# Altium project Driver.PrjPcb
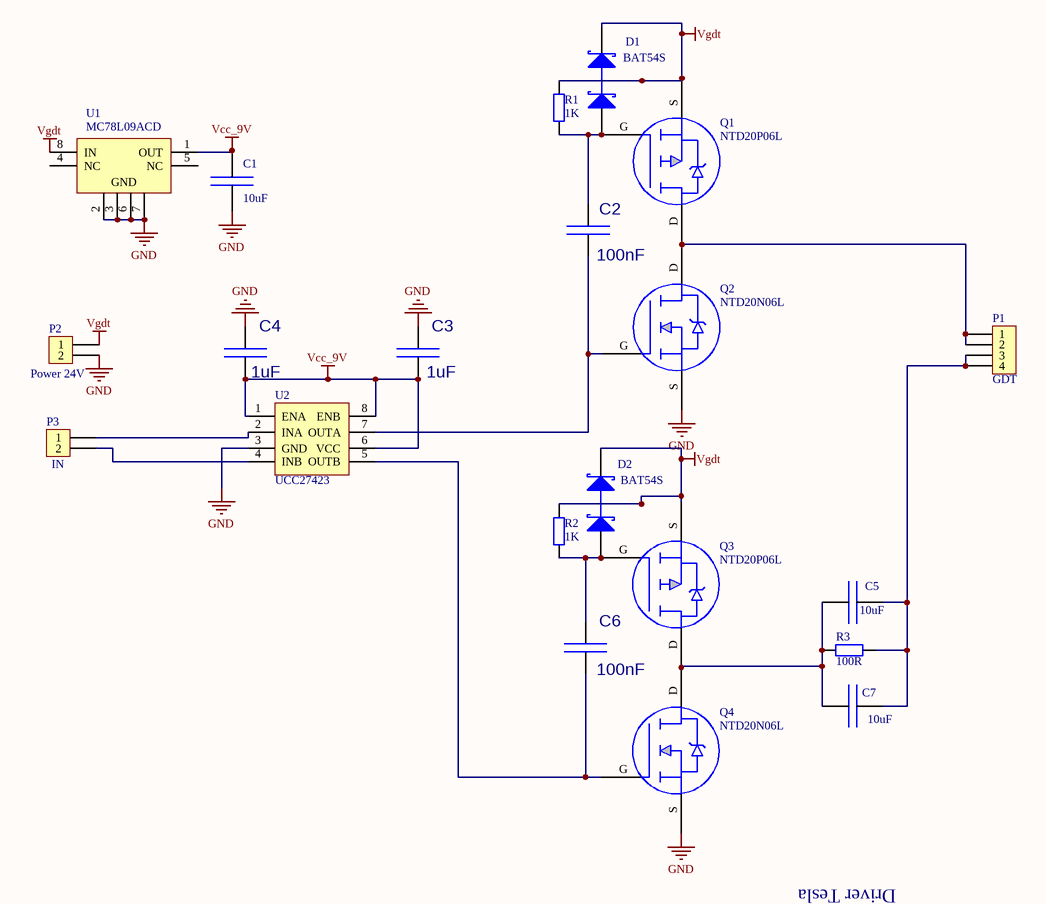
[diagram p0: Driver.SchDoc]
1 sheet, 21 parts. Net scope: global (net labels, ports and power ports of the same name join across sheets).
Board file: Driver.PcbDoc

## Sheet Driver.SchDoc
size A4

### Parts
C1  SMD_1206  [SMD-1206]  (value not drawn)
C2  value 100nF  [C0805]  (hidden comment: KONDENS_SMD)
C3  value 1uF  [C0805]  (hidden comment: KONDENS_SMD)
C4  value 1uF  [C0805]  (hidden comment: KONDENS_SMD)
C5  SMD_1206  [SMD-1206]  (value not drawn)
C6  value 100nF  [C0805]  (hidden comment: KONDENS_SMD)
C7  SMD_1206  [SMD-1206]  (value not drawn)
D1  BAT54S  [SOT23_N]
D2  BAT54S  [SOT23_N]
P1  WF-04MR  [WF-04MR]  (value not drawn)
P2  WF-02MR  [WF-02MR]  (value not drawn)
P3  WF-02MR  [WF-02MR]  (value not drawn)
Q1  NTD20P06L  [DPAK]
Q2  NTD20N06L  [DPAK]
Q3  NTD20P06L  [DPAK]
Q4  NTD20N06L  [DPAK]
R1  value 1K  [C0805]  (hidden comment: RES)
R2  value 1K  [C0805]  (hidden comment: RES)
R3  1206  [SMD-1206]  (value not drawn)
U1  MC78L09ACD  [751-05_N]
U2  UCC27423  [PDIP]

### Nets
GND: C1.2 C3.1(A) C4.1(A) P2.2 Q2.S(Source) Q4.S(Source) U1.2(GND) U1.3(GND) U1.6(GND) U1.7(GND) U2.3(GND)
Vcc_9V: C1.1 C3.2(B) C4.2(B) U1.1(OUT) U2.1(ENA) U2.6(VCC) U2.8(ENB)
Vgdt: D1.2(K) D1.3(C) D2.2(K) D2.3(C) P2.1 Q1.S(Source) Q3.S(Source) R1.2 R2.2 U1.8(IN)
NetC2_1: C2.1(A) D1.1(A) Q1.G(Gate) R1.1
NetC2_2: C2.2(B) Q2.G(Gate) U2.7(OUTA)
NetC5_1: C5.1 C7.1 Q3.D(Drain) Q4.D(Drain) R3.2
NetC5_2: C5.2 C7.2 P1.3 P1.4 R3.1
NetC6_1: C6.1(A) D2.1(A) Q3.G(Gate) R2.1
NetC6_2: C6.2(B) Q4.G(Gate) U2.5(OUTB)
NetP1_1: P1.1 P1.2 Q1.D(Drain) Q2.D(Drain)
NetP3_1: P3.1 U2.2(INA)
NetP3_2: P3.2 U2.4(INB)

Not connected (* = marked no-connect by the designer): U1 4(NC) 5(NC)

### Notes on the sheet
- Driver Tesla
- (in symbol Capasitor SMD_1206) 10uF
- (in symbol Resistor SMD_1206) 100R
- (in symbol WF-02MR) Power 24V; IN
- (in symbol WF-04MR) GDT

### Library data of the parts
C1 C5 C7 = Capasitor SMD_1206
D1 D2 = BAT54S: Schottky Barrier Double Diode; Published: 17-Sep-2003; LatestRevisionDate: 12-Dec-2006; LatestRevisionNote: IPC-7351 Footprint Added.; DatasheetVersion: 4-Mar-2002; PackageVersion: May-1999; PackageReference: SOT23; Publisher: Altium Limited; PackageDescription: 3-Pin SOT-23 Package 0.95 mm Pitch, 2.3 mm Lead Span; ComponentLink1Description: Manufacturer Link; ComponentLink1URL: http://www.semiconductors.philips.com/; ComponentLink2Description: Datasheet; ComponentLink2URL: http://www.semiconductors.philips.com/acrobat/datasheets/BAT54_SERIES_4.pdf
R1 R2 = RES: Resistor
R3 = Resistor SMD_1206
U1 = MC78L09ACD: Three-Terminal Low Current Positive Voltage Regulator; Published: 15-Apr-2002; LatestRevisionDate: 13-Apr-2006; LatestRevisionNote: IPC-7351 Footprint Added.; DatasheetVersion: Oct-1999; PackageVersion: 1998; PackageReference: 751-05; Publisher: Altium Limited; PackageDescription: 8-Pin Small Outline Integrated Circuit 1.27 mm Pitch; Code_JEDEC: MS-012-AA; Code_IPC: SOIC127P600-8; ComponentLink1Description: Manufacturer Link; ComponentLink1URL: http://www.onsemi.com/site/products/taxonomy/0,4438,503,00.html; ComponentLink2Description: Datasheet; ComponentLink2URL: http://www.onsemi.com/pub/Collateral/MC78L00A-D.PDF